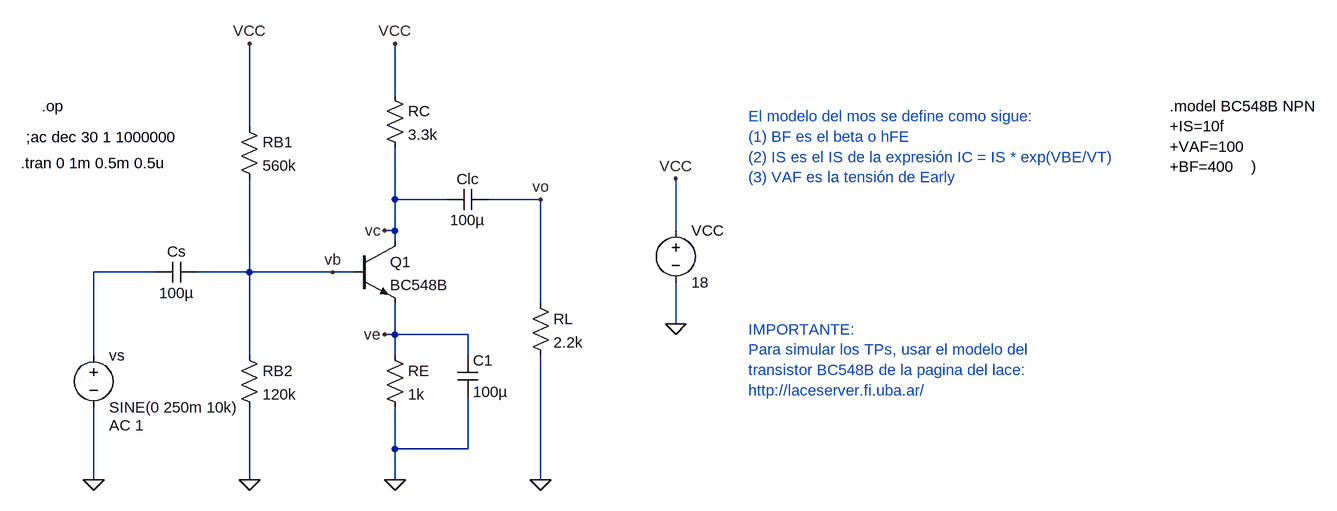
[diagram p0: schematic Parte1.asc]
Parte1.asc, the LTspice schematic file:
Version 4
SHEET 1 1900 872
WIRE -112 -176 -112 -256
WIRE -336 -128 -336 -256
WIRE -112 -16 -112 -96
WIRE -32 -16 -112 -16
WIRE 112 -16 32 -16
WIRE -112 32 -112 -16
WIRE -112 32 -128 32
WIRE 320 32 320 -48
WIRE -112 48 -112 32
WIRE -480 96 -576 96
WIRE -336 96 -336 -48
WIRE -336 96 -416 96
WIRE -208 96 -336 96
WIRE -176 96 -208 96
WIRE 112 144 112 -16
WIRE 320 176 320 112
WIRE -112 192 -112 144
WIRE -112 192 -128 192
WIRE 0 192 -112 192
WIRE -576 224 -576 96
WIRE -336 224 -336 96
WIRE -112 224 -112 192
WIRE 0 224 0 192
WIRE -112 368 -112 304
WIRE 0 368 0 288
WIRE 0 368 -112 368
WIRE -576 416 -576 304
WIRE -336 416 -336 304
WIRE -112 416 -112 368
WIRE 112 416 112 224
FLAG -208 96 vb
FLAG -128 32 vc
FLAG -128 192 ve
FLAG -112 416 0
FLAG -336 416 0
FLAG 112 416 0
FLAG 320 176 0
FLAG 320 -48 VCC
FLAG -112 -256 VCC
FLAG -336 -256 VCC
FLAG -576 416 0
FLAG 112 -16 vo
SYMBOL npn -176 48 R0
SYMATTR InstName Q1
SYMATTR Value BC548B
SYMBOL res -128 208 R0
SYMATTR InstName RE
SYMATTR Value 1k
SYMBOL res -128 -192 R0
SYMATTR InstName RC
SYMATTR Value 3.3k
SYMBOL res -352 208 R0
SYMATTR InstName RB2
SYMATTR Value 120k
SYMBOL res -352 -144 R0
SYMATTR InstName RB1
SYMATTR Value 560k
SYMBOL cap 32 -32 R90
WINDOW 0 0 32 VBottom 2
WINDOW 3 32 32 VTop 2
SYMATTR InstName Clc
SYMATTR Value 100µ
SYMBOL res 96 128 R0
SYMATTR InstName RL
SYMATTR Value 2.2k
SYMBOL voltage 320 16 R0
WINDOW 123 0 0 Left 0
WINDOW 39 0 0 Left 0
SYMATTR InstName VCC
SYMATTR Value 18
SYMBOL cap -416 80 R90
WINDOW 0 0 32 VBottom 2
WINDOW 3 32 32 VTop 2
SYMATTR InstName Cs
SYMATTR Value 100µ
SYMBOL voltage -576 208 R0
WINDOW 123 24 124 Left 2
WINDOW 39 0 0 Left 0
SYMATTR Value2 AC 1
SYMATTR InstName vs
SYMATTR Value SINE(0 250m 10k)
SYMBOL cap -16 224 R0
SYMATTR InstName C1
SYMATTR Value 100µ
TEXT 1080 -160 Left 2 !.model BC548B NPN\n+IS=10f\n+VAF=100\n+BF=400    )
TEXT 432 -144 Left 2 ;El modelo del mos se define como sigue:\n(1) BF es el beta o hFE\n(2) IS es el IS de la expresión IC = IS * exp(VBE/VT)\n(3) VAF es la tensión de Early
TEXT 432 184 Left 2 ;IMPORTANTE:\nPara simular los TPs, usar el modelo del \ntransistor BC548B de la pagina del lace:\nhttp://laceserver.fi.uba.ar/
TEXT -688 -72 Left 2 !.tran 0 1m 0.5m 0.5u
TEXT -680 -112 Left 2 !;ac dec 30 1 1000000
TEXT -656 -160 Left 2 !.op

The netlist it stands for:
* Parte1.asc
Q1 vc vb ve 0 BC548B
RE ve 0 1k
RC VCC vc 3.3k
RB2 vb 0 120k
RB1 VCC vb 560k
Clc vo vc 100µ
RL vo 0 2.2k
VCC VCC 0 18
Cs vb N001 100µ
vs N001 0 SINE(0 250m 10k) AC 1
C1 ve 0 100µ
.model NPN NPN
.model PNP PNP
.lib standard.bjt
.model BC548B NPN
+IS=10f
+VAF=100
+BF=400    )
* El modelo del mos se define como sigue:
* (1) BF es el beta o hFE
* (2) IS es el IS de la expresión IC = IS * exp(VBE/VT)
* (3) VAF es la tensión de Early
* IMPORTANTE:
* Para simular los TPs, usar el modelo del
* transistor BC548B de la pagina del lace:
* http://laceserver.fi.uba.ar/
.tran 0 1m 0.5m 0.5u
;ac dec 30 1 1000000
.op
.backanno
.end

* Results of the author's LTspice run, read from the files saved beside the schematic
* Operating Point, zero values left out:
*   V(vc) = 11.28 V
*   V(vb) = 2.713 V
*   V(ve) = 2.042 V
*   V(vcc) = 18 V
*   Ic(Q1) = 2.037 mA
*   Ib(Q1) = 4.691 µA
*   Ie(Q1) = -2.042 mA
*   I(Rb1) = 27.3 µA
*   I(Rb2) = 22.61 µA
*   I(Rc) = 2.037 mA
*   I(Re) = 2.042 mA
*   I(Vcc) = -2.064 mA
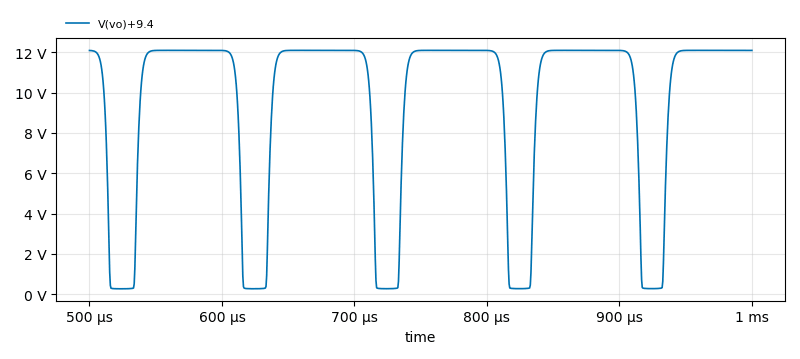
[diagram p1: Transient Analysis of Parte1.asc, plotted from the saved traces]
* Transient Analysis, 1 run:
*   V(vo)+9.4: min 274.4 mV, max 12.09 V, average 9.402 V, rms 10.46 V, last 12.09 V